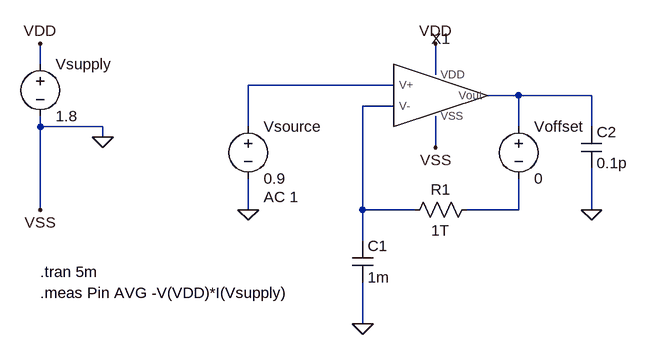
[diagram p0: schematic SIM_oper_point.asc]
SIM_oper_point.asc, the LTspice schematic file:
Version 4
SHEET 1 880 680
WIRE -432 112 -432 80
WIRE 176 128 176 80
WIRE 112 144 -112 144
WIRE 304 160 256 160
WIRE 416 160 304 160
WIRE 112 176 64 176
WIRE -432 208 -432 192
WIRE -336 208 -432 208
WIRE -112 208 -112 144
WIRE 304 208 304 160
WIRE 416 208 416 160
WIRE -336 224 -336 208
WIRE 176 240 176 192
WIRE -432 336 -432 208
WIRE -112 336 -112 288
WIRE 64 336 64 176
WIRE 144 336 64 336
WIRE 304 336 304 288
WIRE 304 336 224 336
WIRE 416 336 416 272
WIRE 64 384 64 336
WIRE 64 512 64 448
FLAG -112 336 0
FLAG 64 512 0
FLAG -336 224 0
FLAG 176 80 VDD
FLAG -432 80 VDD
FLAG 176 240 VSS
FLAG -432 336 VSS
FLAG 416 336 0
DATAFLAG 304 160 ""
DATAFLAG -96 144 ""
DATAFLAG 64 336 ""
DATAFLAG 64 352 ""
SYMBOL res 240 320 R90
WINDOW 0 0 56 VBottom 2
WINDOW 3 32 56 VTop 2
SYMATTR InstName R1
SYMATTR Value 1T
SYMBOL voltage -112 192 R0
WINDOW 123 24 124 Left 2
WINDOW 39 0 0 Left 0
SYMATTR Value2 AC 1
SYMATTR InstName Vsource
SYMATTR Value 0.9
SYMBOL voltage -432 96 R0
WINDOW 123 0 0 Left 0
WINDOW 39 0 0 Left 0
SYMATTR InstName Vsupply
SYMATTR Value 1.8
SYMBOL cap 48 384 R0
SYMATTR InstName C1
SYMATTR Value 1m
SYMBOL cap 400 208 R0
SYMATTR InstName C2
SYMATTR Value 0.1p
SYMBOL voltage 304 192 R0
WINDOW 123 0 0 Left 0
WINDOW 39 0 0 Left 0
SYMATTR InstName Voffset
SYMATTR Value 0
SYMBOL OpAmp_V1 176 160 R0
SYMATTR InstName X1
TEXT -432 432 Left 2 !.tran 5m
TEXT -432 464 Left 2 !.meas Pin AVG -V(VDD)*I(Vsupply)

The netlist it stands for:
* SIM_oper_point.asc
R1 N004 N003 1T
Vsource N001 0 0.9 AC 1
Vsupply VDD 0 1.8
C1 N003 0 1m
C2 N002 0 0.1p
Voffset N002 N004 0
XX1 N001 N003 VDD 0 N002 OpAmp_V1  ; pins V+ V- VDD VSS Vout
.tran 5m
.meas Pin AVG -V(VDD)*I(Vsupply)
.backanno
.end